# Altium schematic sheet esquematico_tsal_mainhoop.SchDoc
size A4; SheetNumber: 1; SheetTotal: 1
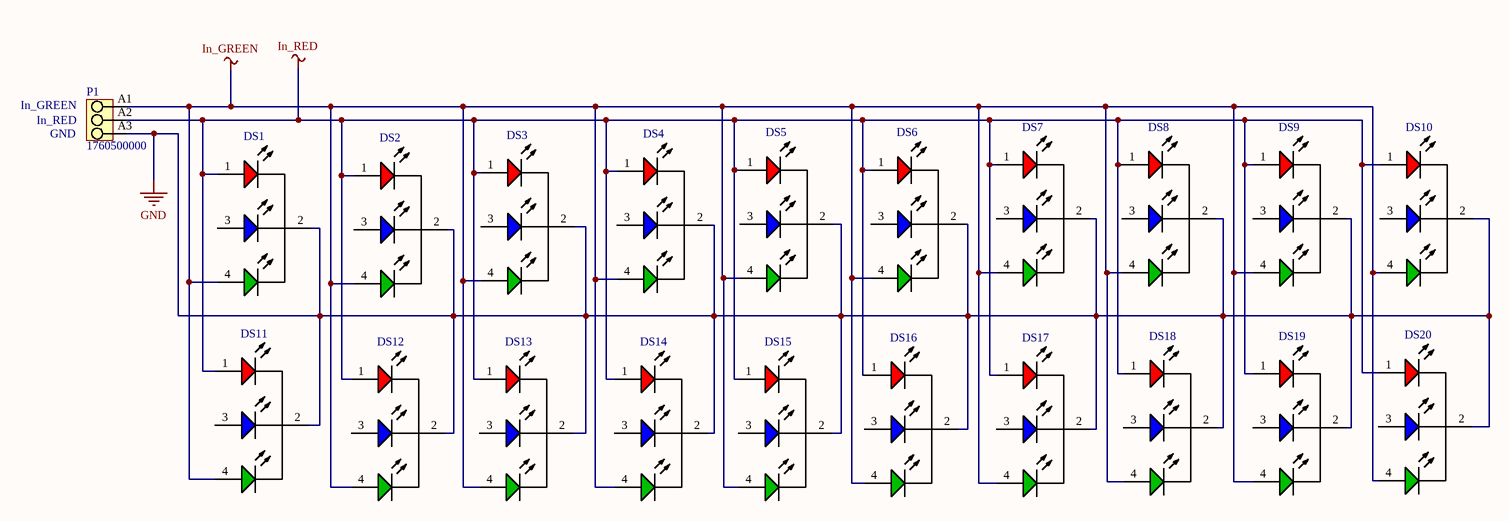
[diagram p0: esquematico_tsal_mainhoop.SchDoc]

## Parts
DS1  WP154A4SUREQBFZGC  [KING-WP154A4SUREQBFZGC_V]  (value not drawn)
DS2  WP154A4SUREQBFZGC  [KING-WP154A4SUREQBFZGC_V]  (value not drawn)
DS3  WP154A4SUREQBFZGC  [KING-WP154A4SUREQBFZGC_V]  (value not drawn)
DS4  WP154A4SUREQBFZGC  [KING-WP154A4SUREQBFZGC_V]  (value not drawn)
DS5  WP154A4SUREQBFZGC  [KING-WP154A4SUREQBFZGC_V]  (value not drawn)
DS6  WP154A4SUREQBFZGC  [KING-WP154A4SUREQBFZGC_V]  (value not drawn)
DS7  WP154A4SUREQBFZGC  [KING-WP154A4SUREQBFZGC_V]  (value not drawn)
DS8  WP154A4SUREQBFZGC  [KING-WP154A4SUREQBFZGC_V]  (value not drawn)
DS9  WP154A4SUREQBFZGC  [KING-WP154A4SUREQBFZGC_V]  (value not drawn)
DS10  WP154A4SUREQBFZGC  [KING-WP154A4SUREQBFZGC_V]  (value not drawn)
DS11  WP154A4SUREQBFZGC  [KING-WP154A4SUREQBFZGC_V]  (value not drawn)
DS12  WP154A4SUREQBFZGC  [KING-WP154A4SUREQBFZGC_V]  (value not drawn)
DS13  WP154A4SUREQBFZGC  [KING-WP154A4SUREQBFZGC_V]  (value not drawn)
DS14  WP154A4SUREQBFZGC  [KING-WP154A4SUREQBFZGC_V]  (value not drawn)
DS15  WP154A4SUREQBFZGC  [KING-WP154A4SUREQBFZGC_V]  (value not drawn)
DS16  WP154A4SUREQBFZGC  [KING-WP154A4SUREQBFZGC_V]  (value not drawn)
DS17  WP154A4SUREQBFZGC  [KING-WP154A4SUREQBFZGC_V]  (value not drawn)
DS18  WP154A4SUREQBFZGC  [KING-WP154A4SUREQBFZGC_V]  (value not drawn)
DS19  WP154A4SUREQBFZGC  [KING-WP154A4SUREQBFZGC_V]  (value not drawn)
DS20  WP154A4SUREQBFZGC  [KING-WP154A4SUREQBFZGC_V]  (value not drawn)
P1  1760500000  [PM_5_08_90_03]

## Nets
GND: DS1.2(CATHODE) DS2.2(CATHODE) DS3.2(CATHODE) DS4.2(CATHODE) DS5.2(CATHODE) DS6.2(CATHODE) DS7.2(CATHODE) DS8.2(CATHODE) DS9.2(CATHODE) DS10.2(CATHODE) DS11.2(CATHODE) DS12.2(CATHODE) DS13.2(CATHODE) DS14.2(CATHODE) DS15.2(CATHODE) DS16.2(CATHODE) DS17.2(CATHODE) DS18.2(CATHODE) DS19.2(CATHODE) DS20.2(CATHODE) P1.A3
In_GREEN: DS1.4(GREEN) DS2.4(GREEN) DS3.4(GREEN) DS4.4(GREEN) DS5.4(GREEN) DS6.4(GREEN) DS7.4(GREEN) DS8.4(GREEN) DS9.4(GREEN) DS10.4(GREEN) DS11.4(GREEN) DS12.4(GREEN) DS13.4(GREEN) DS14.4(GREEN) DS15.4(GREEN) DS16.4(GREEN) DS17.4(GREEN) DS18.4(GREEN) DS19.4(GREEN) DS20.4(GREEN) P1.A1
In_RED: DS1.1(RED) DS2.1(RED) DS3.1(RED) DS4.1(RED) DS5.1(RED) DS6.1(RED) DS7.1(RED) DS8.1(RED) DS9.1(RED) DS10.1(RED) DS11.1(RED) DS12.1(RED) DS13.1(RED) DS14.1(RED) DS15.1(RED) DS16.1(RED) DS17.1(RED) DS18.1(RED) DS19.1(RED) DS20.1(RED) P1.A2

Not connected (* = marked no-connect by the designer): DS1 3(BLUE); DS2 3(BLUE); DS3 3(BLUE); DS4 3(BLUE); DS5 3(BLUE); DS6 3(BLUE); DS7 3(BLUE); DS8 3(BLUE); DS9 3(BLUE); DS10 3(BLUE); DS11 3(BLUE); DS12 3(BLUE); DS13 3(BLUE); DS14 3(BLUE); DS15 3(BLUE); DS16 3(BLUE); DS17 3(BLUE); DS18 3(BLUE); DS19 3(BLUE); DS20 3(BLUE)

## Notes on the sheet
- (near P1) In_GREEN
- (near P1) In_RED
- (near P1) GND

## Library data of the parts
DS1-DS20 = CMP-2000-07415-1: Full Color LED Lamp, Dominant Wavelength RGB 630 / 525 / 465 nm, -40 to 85 degC, 4-Pin THD, RoHS; Manufacturer: Kingbright; Viewing Angle: 50°; Wavelength - Dominant: 630nm,525nm,465nm; Online Catalog: 5mm,T-13/4(RGB)RoundwithDomedTopLEDLamp; Millicandela Rating: 1300mcdRed,1700mcdGreen,900mcdBlue; Other Names: 754-1615 / WP154A4SUREQBFZGC-ND; Current - Test: 20mA; Wavelength - Peak: 645nm,515nm,460nm; Color: Red,Green,Blue(RGB); Voltage - Forward (Vf) (Typ): 1.9VRed,3.3VGreen,3.3VBlue; Lens Type: Clear; 3D Model: WP154A4SUREQBFZGW.sldprt / WP154A4SUREQBFZGW.pro / WP154A4SUREQBFZGW.igs / WP154A4SUREQBFZGW.stp; Lens Style/Size: RoundwithDomedTop,5mm,T-13/4; Packaging: Bulk; Datasheet URL: https://www.kingbrightusa.com/images/catalog/spec/WP154A4SUREQBFZGC.pdf; Family: LEDIndication-Discrete; Datasheet Version: Rev. 5A, 08/2014; Category: Optoelectronics; Manufacturer URL: http://www.kingbright.com/; Height: 8.60mm; Mounting Type: ThroughHole; Package Reference: WP154A4SUREQBFZGC; Mounting Technology: ThroughHole; Package Description: 4-Pin Through Hole LED, Dia 5.9 mm, Pitch 1.27 mm; Standard Package: 500; Package / Case: Radial-4Leads
P1 = CMP-1559-01629-1: OMNIMATE Signal - series PM; Manufacturer: Weidmueller; Pitch_mm: 5,08 mm; Pitch_inch: 0,2 inch; Wire_cross_section_AWG_min_UL_1059: AWG 26; Contact_surface: tinned; Contact_material: Cu-Leg; Short_text_for_material: PM 5.08/03/90 3.5SN OR BX; Rated_voltage_use_group_B_UL_1059: 300 V; Solid_min_H05_07_V_U: 0,13 mm²; Solder_pin_length_mm: 3,5 mm; Rated_voltage_for_surge_voltage_class_pollution_degree_II_2: 600 V; Mounting_onto_the_PCB: Solder connection; Solid_max_H05_07_V_U: 2,5 mm²; Side_termination_characteristic: closed side; Rated_current_use_group_B_UL_1059: 15 A; Wire_cross_section_AWG_max_UL_1059: AWG 14; Insulating_material: Wemid (PA); UL_94_flammability_rating: V-0; No_of_poles: 3; ComponentLink2Description: URL Link1; ComponentLink1Description: Manufacturer URL; PartNumber: 1760500000; ComponentLink2URL: http://catalog.weidmueller.com/catalog/Start.do?localeId=en&ObjectID=1760500000; ComponentLink1URL: http://www.weidmueller.com/; Qty: 500 PCS; Colour: Orange; Packaging: Box; Revision: V1; PackageReference: PM_5_08_90_03